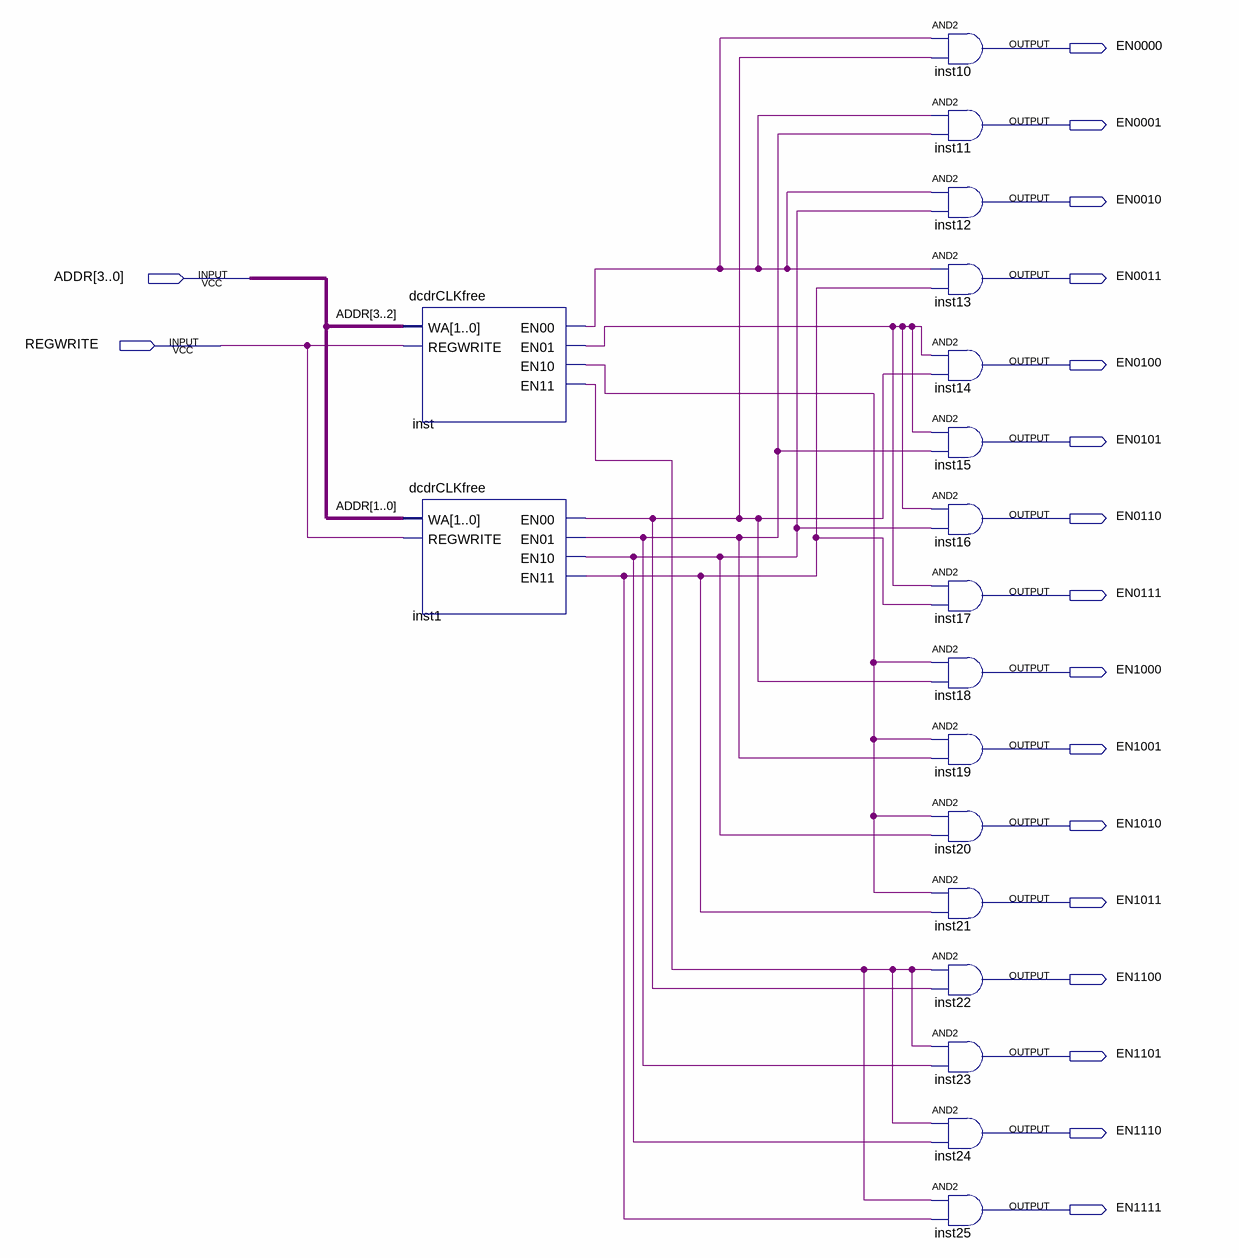
[diagram p0: schematic sheet]
// Quartus schematic dcdr4bit.bdf as structural Verilog: 18 symbols, 18 pins
module dcdr4bit (
  input  [3:0] ADDR,
  input  REGWRITE,
  output EN0000,
  output EN0001,
  output EN0010,
  output EN0011,
  output EN0100,
  output EN0101,
  output EN0110,
  output EN0111,
  output EN1000,
  output EN1001,
  output EN1010,
  output EN1011,
  output EN1100,
  output EN1101,
  output EN1110,
  output EN1111
);

  wire inst1_en00, inst1_en01, inst1_en10, inst1_en11, inst_en00, inst_en01, inst_en10, inst_en11;

  dcdrCLKfree inst (
    .WA(ADDR[3:2]), .REGWRITE(REGWRITE), .EN00(inst_en00), .EN01(inst_en01), .EN10(inst_en10),
    .EN11(inst_en11));
  dcdrCLKfree inst1 (
    .WA(ADDR[1:0]), .REGWRITE(REGWRITE), .EN00(inst1_en00), .EN01(inst1_en01), .EN10(inst1_en10),
    .EN11(inst1_en11));
  and inst10 (EN0000, inst_en00, inst1_en00);
  and inst11 (EN0001, inst_en00, inst1_en01);
  and inst12 (EN0010, inst_en00, inst1_en10);
  and inst13 (EN0011, inst_en00, inst1_en11);
  and inst14 (EN0100, inst_en01, inst1_en00);
  and inst15 (EN0101, inst_en01, inst1_en01);
  and inst16 (EN0110, inst_en01, inst1_en10);
  and inst17 (EN0111, inst_en01, inst1_en11);
  and inst18 (EN1000, inst_en10, inst1_en00);
  and inst19 (EN1001, inst_en10, inst1_en01);
  and inst20 (EN1010, inst_en10, inst1_en10);
  and inst21 (EN1011, inst_en10, inst1_en11);
  and inst22 (EN1100, inst_en11, inst1_en00);
  and inst23 (EN1101, inst_en11, inst1_en01);
  and inst24 (EN1110, inst_en11, inst1_en10);
  and inst25 (EN1111, inst_en11, inst1_en11);
endmodule
